# EAGLE design USBToILDAvAlpha (EAGLE 9.0.1)
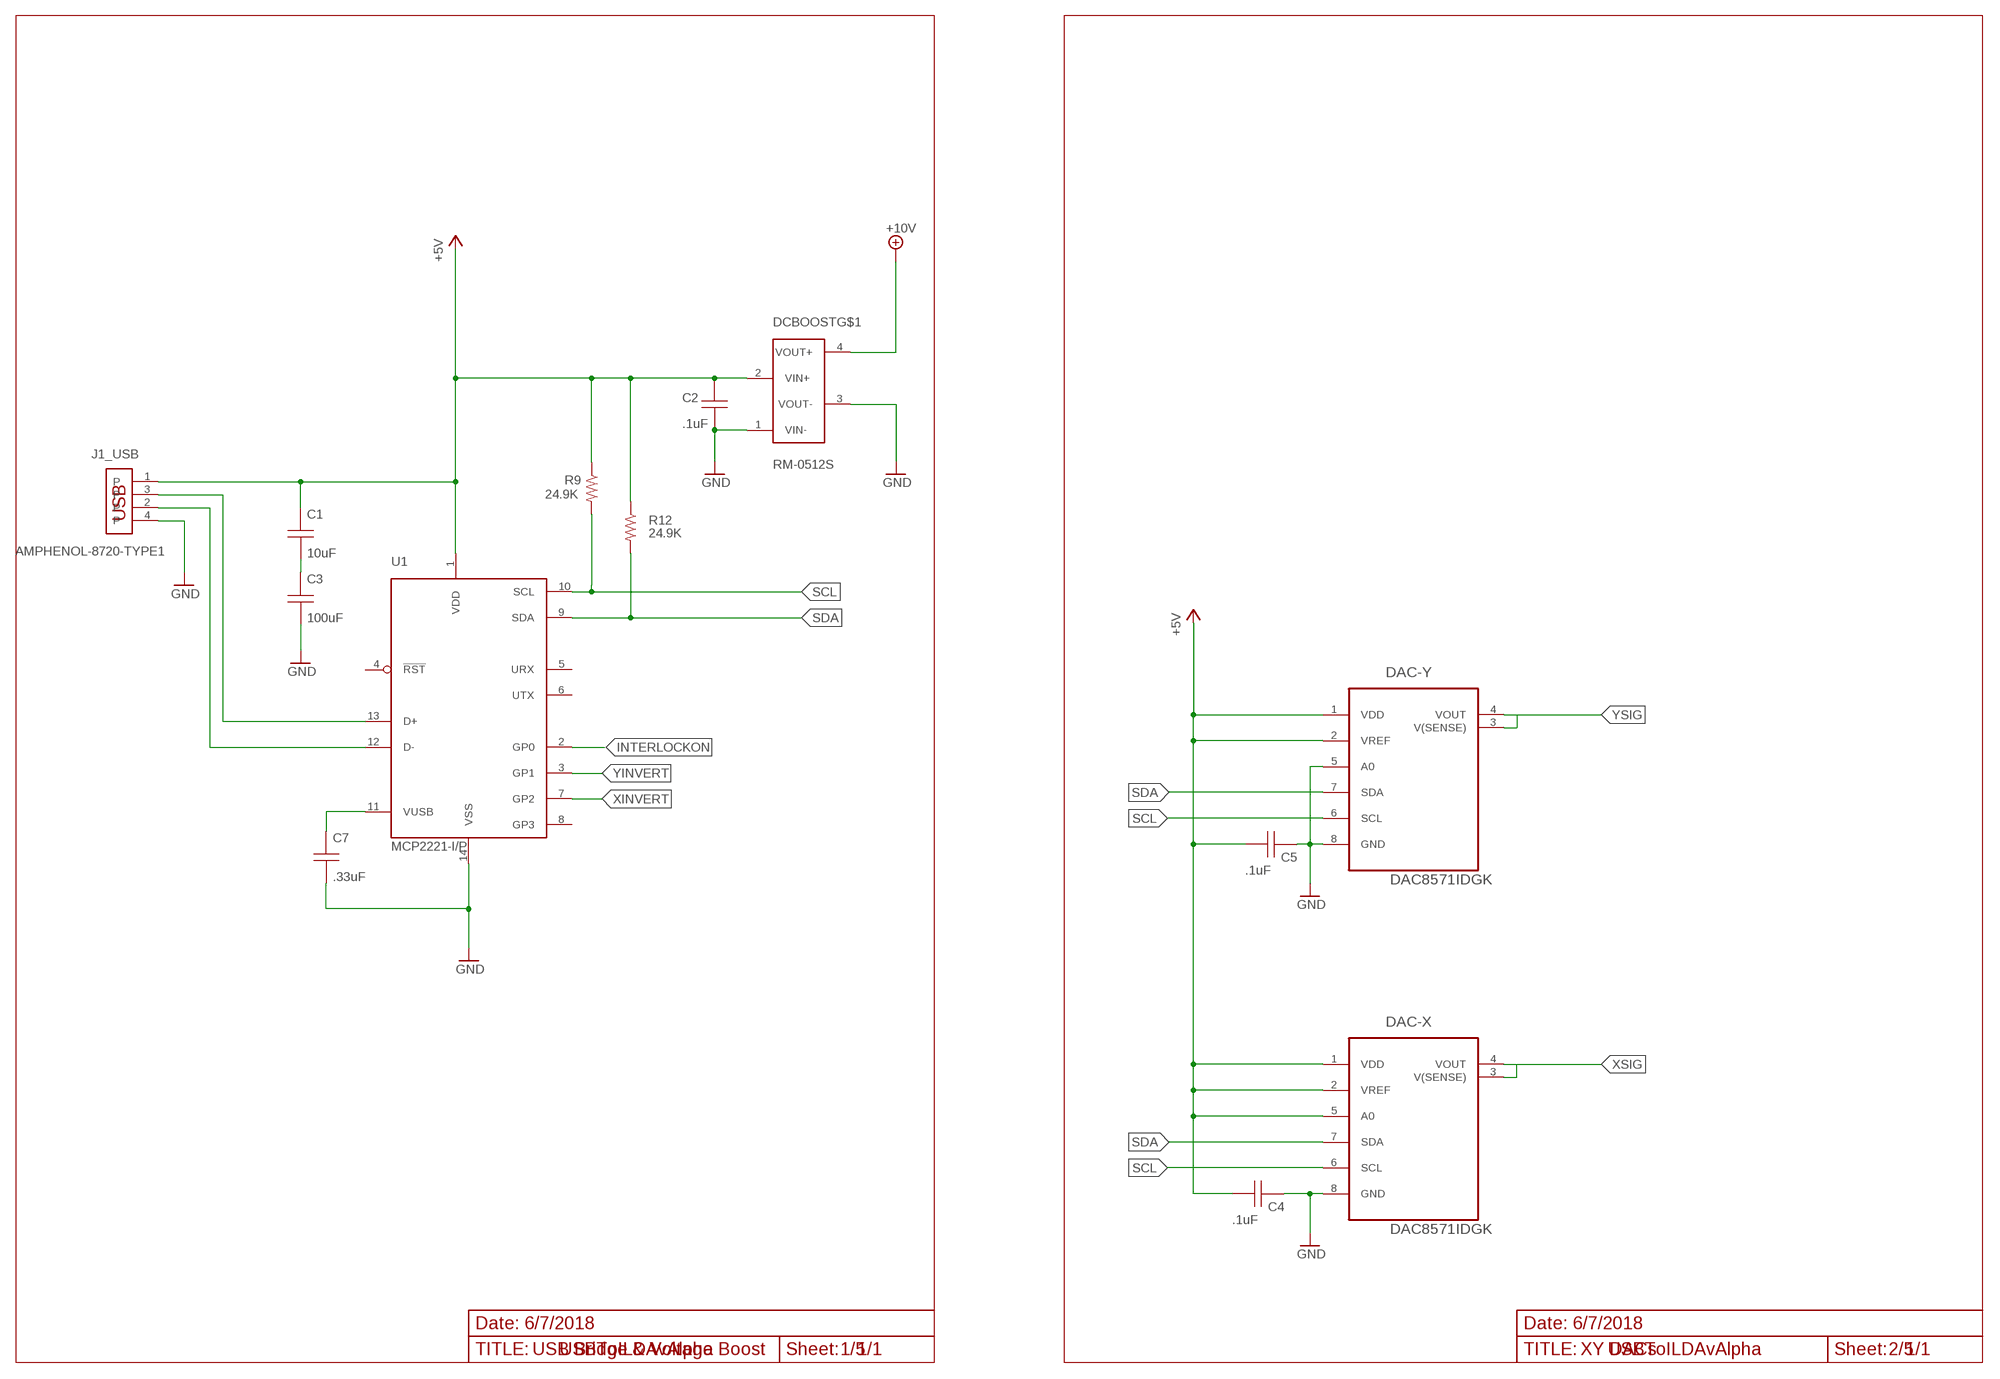
[diagram p0: schematic, sheet 1, part 1 of 3]
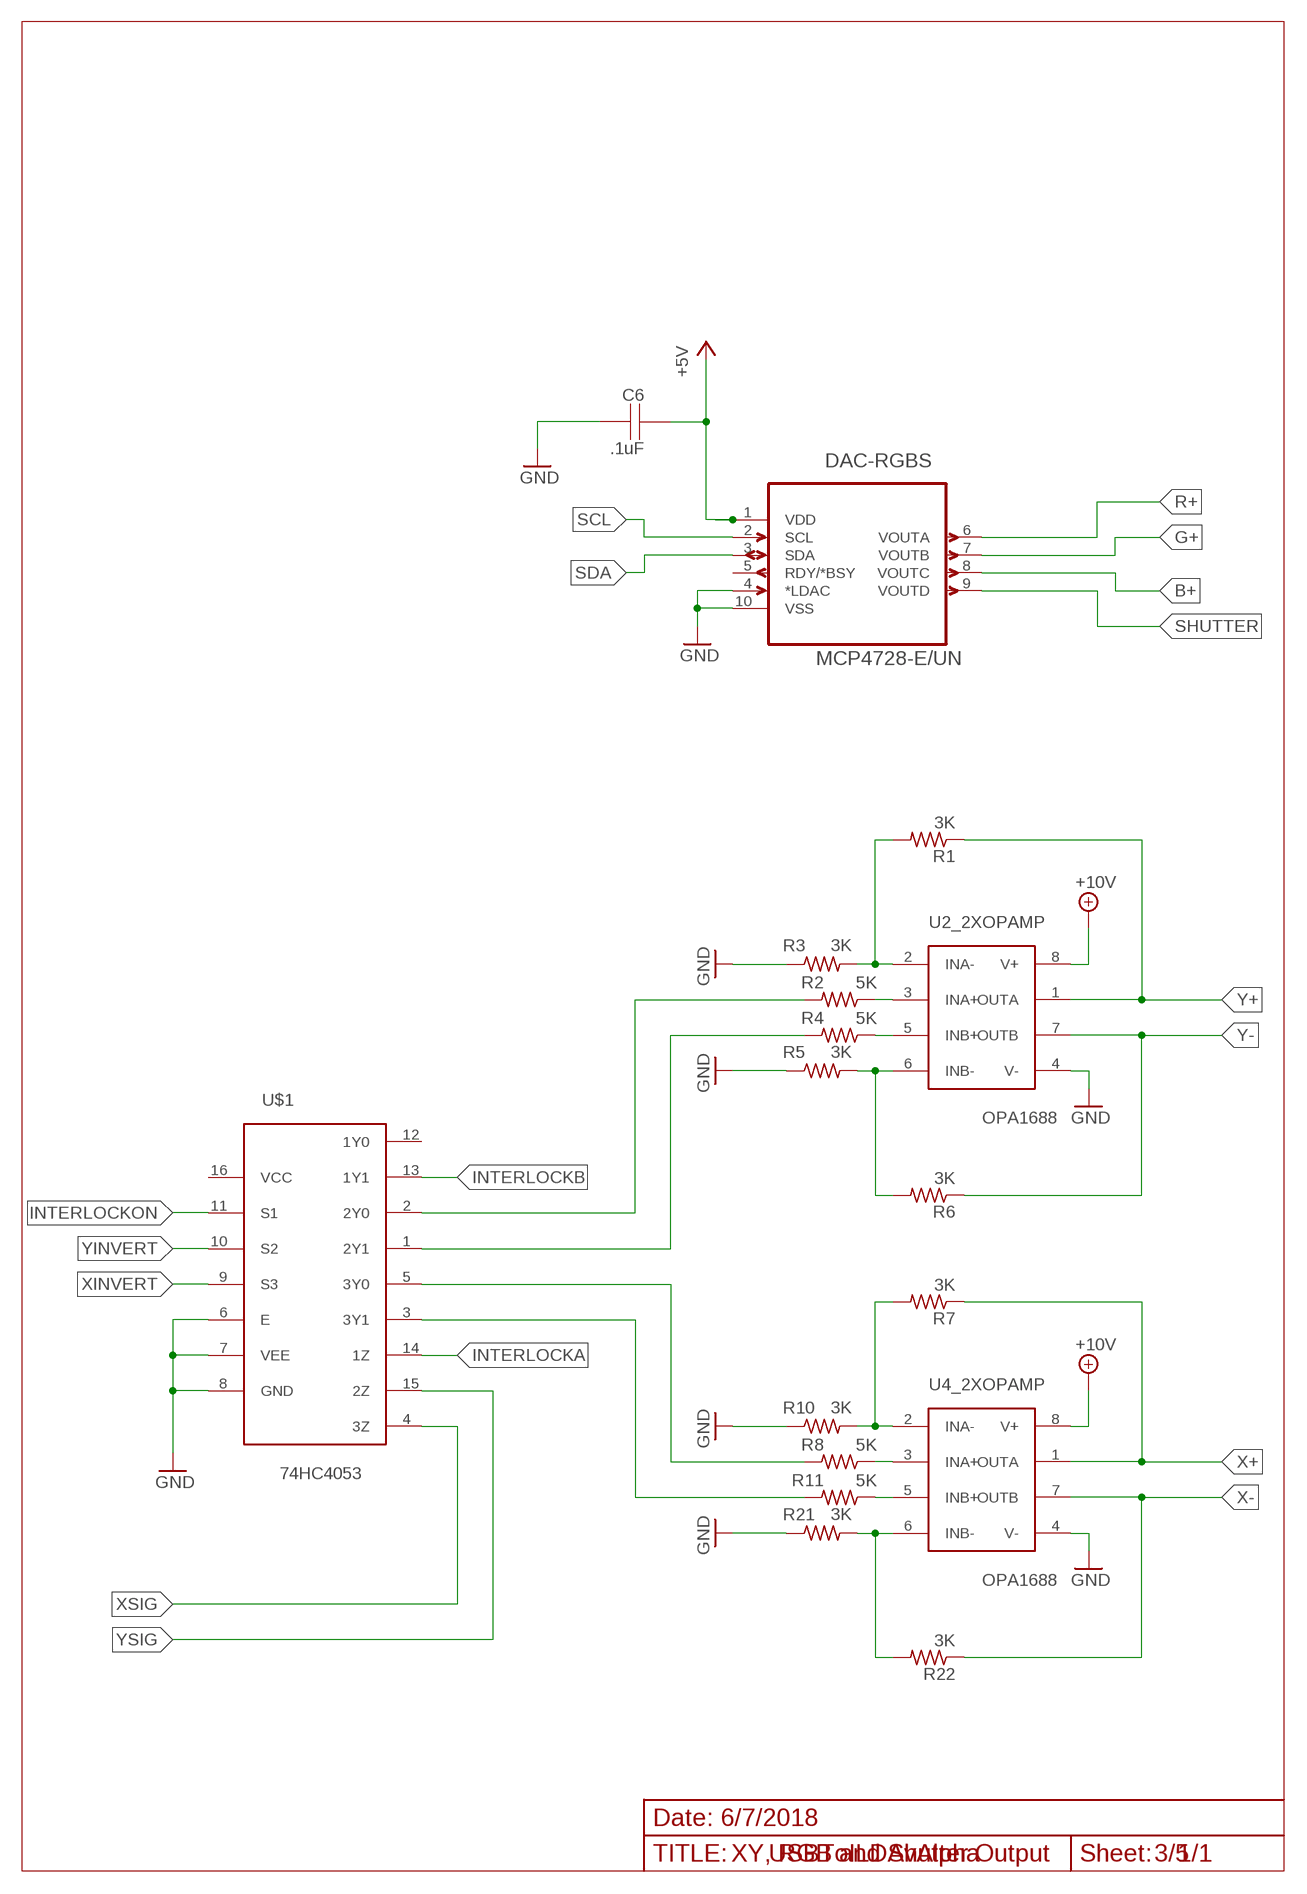
[diagram p1: schematic, sheet 1, part 2 of 3]
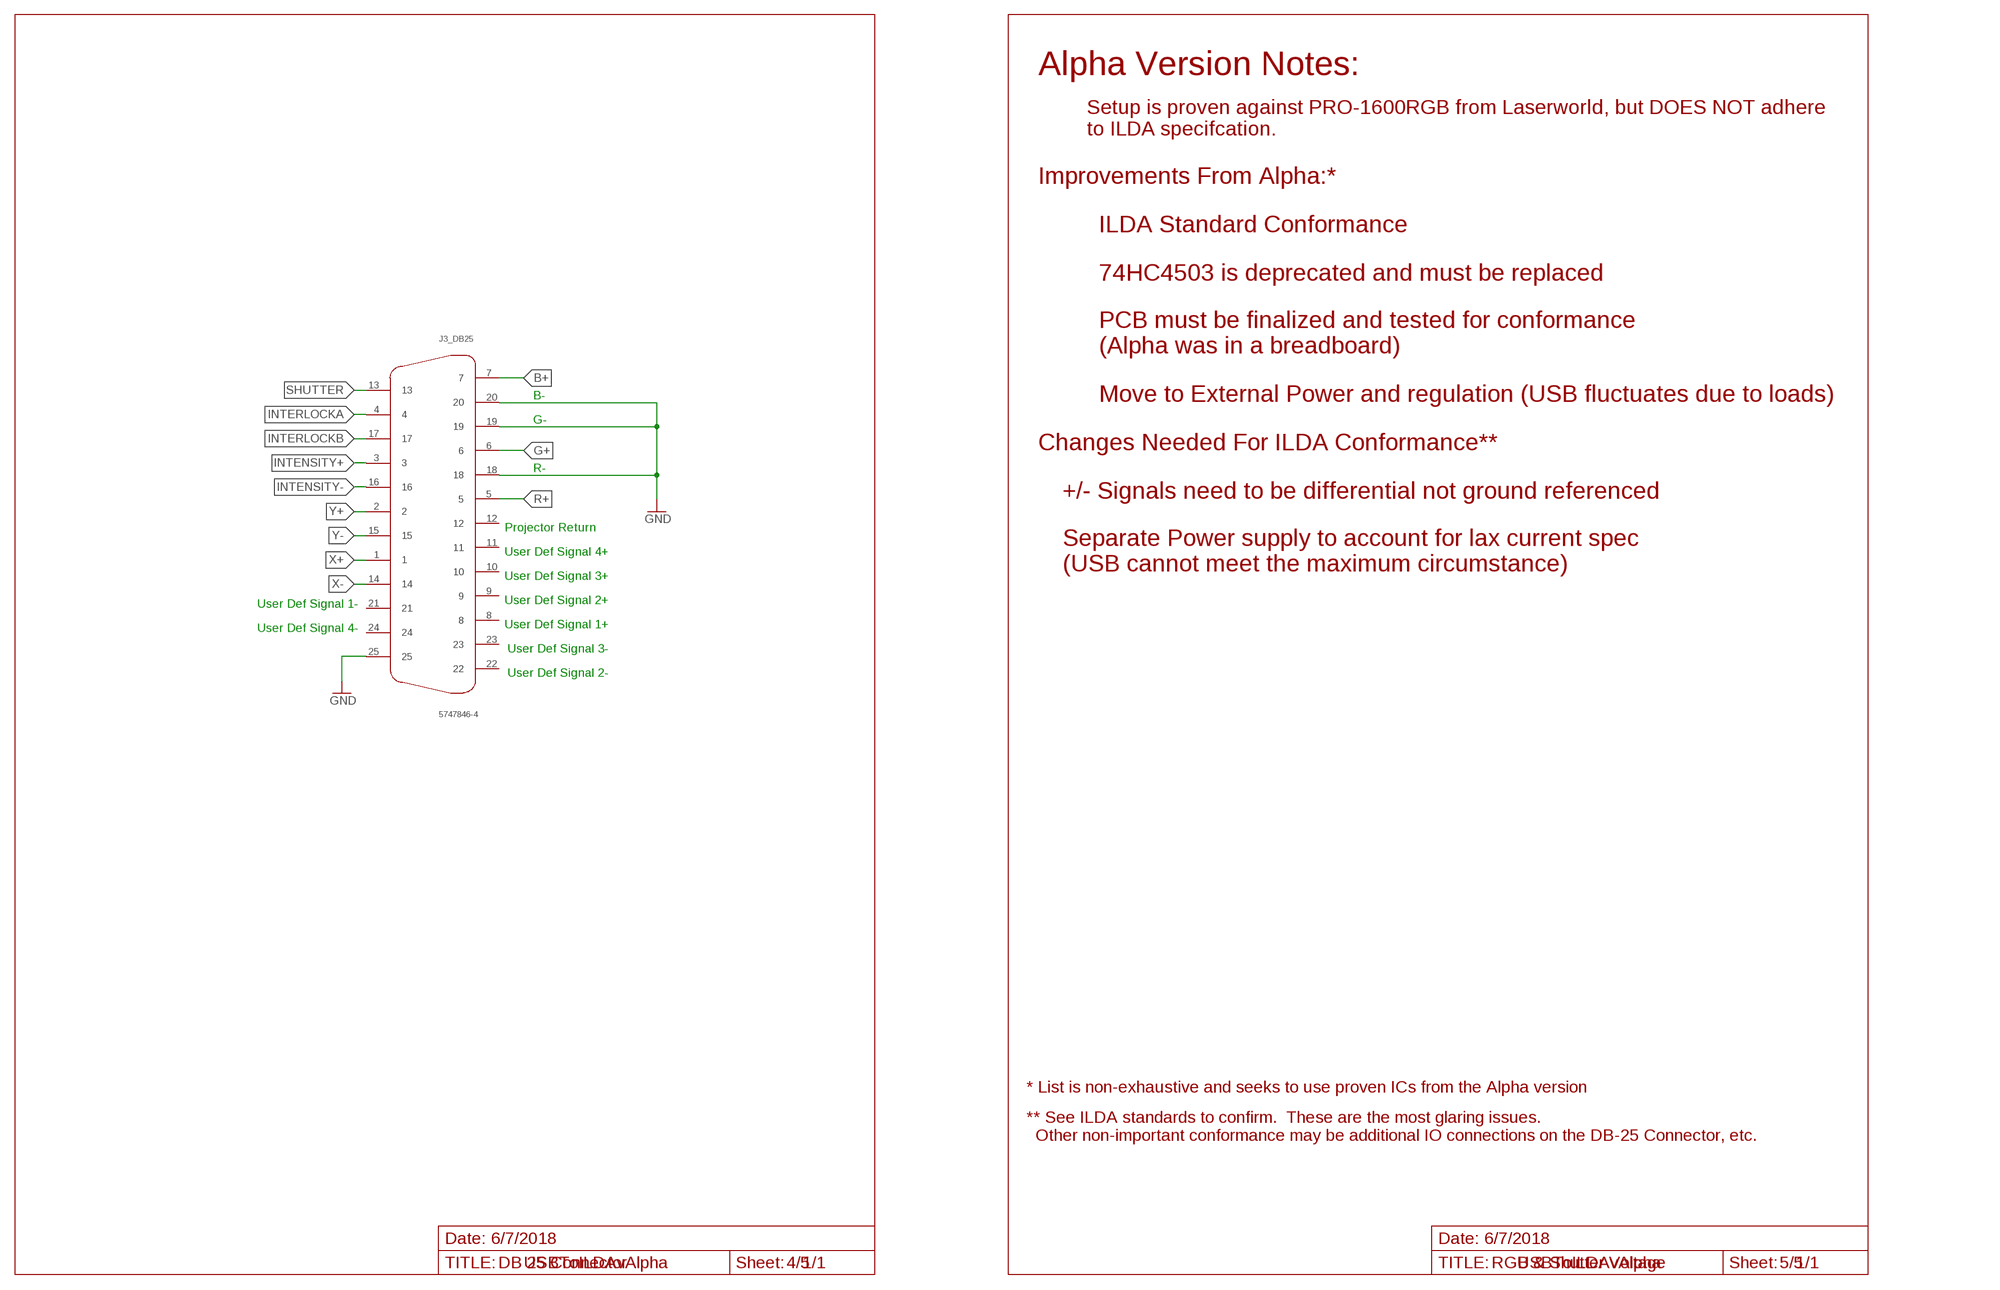
[diagram p2: schematic, sheet 1, part 3 of 3]

## Parts
C1  10uF  RCER71H106MWM1H03A  [WM1]
C2  .1uF  RCER71H106MWM1H03A  [WM1]
C3  100uF  RCER71H106MWM1H03A  [WM1]
C4  .1uF  RCER71H106MWM1H03A  [WM1]
C5  .1uF  RCER71H106MWM1H03A  [WM1]
C6  .1uF  RCER71H106MWM1H03A  [WM1]
C7  .33uF  RCER71H106MWM1H03A  [WM1]
DAC-RGBS  MCP4728-E/UN  [SOP50P490X110-10N]
DAC-X  DAC8571IDGK  [SOP65P490X110-8N]
DAC-Y  DAC8571IDGK  [SOP65P490X110-8N]
DCBOOST  RM-0512S  RM-XXXXS  [SIP-4]
J1_  AMPHENOL-8720-TYPE1  [87520]
J3_  5747846-4  [5747846-4]
R1  3K  R-US_01005  [R01005]
R2  5K  R-US_01005  [R01005]
R3  3K  R-US_01005  [R01005]
R4  5K  R-US_01005  [R01005]
R5  3K  R-US_01005  [R01005]
R6  3K  R-US_01005  [R01005]
R7  3K  R-US_01005  [R01005]
R8  5K  R-US_01005  [R01005]
R9  24.9K  R-US_01005  [R01005]
R10  3K  R-US_01005  [R01005]
R11  5K  R-US_01005  [R01005]
R12  24.9K  R-US_01005  [R01005]
R21  3K  R-US_01005  [R01005]
R22  3K  R-US_01005  [R01005]
U1  MCP2221-I/P  [DIL14]
U2  OPA1688  [SOIC-8]
U4  OPA1688  [SOIC-8]
U$1  74HC4053  [SO16]

## Nets
+5V: C1.P$1(A) C2.P$1(A) C4.P$1(A) C5.P$1(A) C6.P$2(B) DAC-RGBS.1(VDD) DAC-X.1(VDD) DAC-X.2(VREF) DAC-X.5(A0) DAC-Y.1(VDD) DAC-Y.2(VREF) DCBOOST.2(2:VIN+) J1_.1(1:P) R9.1 R12.1 U1.1(VDD)
+9V: DCBOOST.4(4:VOUT+) ; supply symbol labelled +10V
+10V: U2.8(8:V+) U4.8(8:V+)
B+: DAC-RGBS.8(VOUTC) J3_.7
G+: DAC-RGBS.7(VOUTB) J3_.6
GND: C2.P$2(B) C3.P$2(B) C4.P$2(B) C5.P$2(B) C6.P$1(A) C7.P$2(B) DAC-RGBS.4(*LDAC) DAC-RGBS.10(VSS) DAC-X.8(GND) DAC-Y.5(A0) DAC-Y.8(GND) DCBOOST.1(1:VIN-) DCBOOST.3(3:VOUT-) J1_.4(4:P) J3_.18 J3_.19 J3_.20 J3_.25 R3.1 R5.1 R10.1 R21.1 U1.14(VSS) U2.4(4:V-) U4.4(4:V-) U$1.6(E) U$1.7(VEE) U$1.8(GND)
INTENSITY+: J3_.3
INTENSITY-: J3_.16
INTERLOCKA: J3_.4 U$1.14(1Z)
INTERLOCKB: J3_.17 U$1.13(1Y1)
INTERLOCKON: U1.2(GP0) U$1.11(S1)
N$1: C1.P$2(B) C3.P$1(A)
N$2: J1_.2(2:P) U1.12(D-)
N$3: J1_.3(3:P) U1.13(D+)
N$4: R1.2 R3.2 U2.2(2:INA-)
N$6: DAC-RGBS.9(VOUTD)
N$7: R2.1 U2.3(3:INA+)
N$8: R2.2 U$1.2(2Y0)
N$9: R7.2 R10.2 U4.2(2:INA-)
N$10: R8.1 U4.3(3:INA+)
N$11: R8.2 U$1.5(3Y0)
N$12: R4.2 U$1.1(2Y1)
N$14: R4.1 U2.5(5:INB+)
N$15: R11.2 U$1.3(3Y1)
N$16: R5.2 R6.2 U2.6(6:INB-)
N$17: C7.P$1(A) U1.11(VUSB)
N$18: R11.1 U4.5(5:INB+)
N$19: R21.2 R22.2 U4.6(6:INB-)
R+: DAC-RGBS.6(VOUTA) J3_.5
SCL: DAC-RGBS.2(SCL) DAC-X.6(SCL) DAC-Y.6(SCL) R9.2 U1.10(SCL)
SDA: DAC-RGBS.3(SDA) DAC-X.7(SDA) DAC-Y.7(SDA) R12.2 U1.9(SDA)
SHUTTER: J3_.13
X+: J3_.1 R7.1 U4.1(1:OUTA)
X-: J3_.14 R22.1 U4.7(7:OUTB)
XINVERT: U1.7(GP2) U$1.9(S3)
XSIG: DAC-X.3(V(SENSE)) DAC-X.4(VOUT) U$1.4(3Z)
Y+: J3_.2 R1.1 U2.1(1:OUTA)
Y-: J3_.15 R6.1 U2.7(7:OUTB)
YINVERT: U1.3(GP1) U$1.10(S2)
YSIG: DAC-Y.3(V(SENSE)) DAC-Y.4(VOUT) U$1.15(2Z)
Unconnected: DAC-RGBS.5(RDY/*BSY) J3_.8 J3_.9 J3_.10 J3_.11 J3_.12 J3_.21 J3_.22 J3_.23 J3_.24 U1.4(!RST) U1.5(URX) U1.6(UTX) U1.8(GP3) U$1.12(1Y0) U$1.16(VCC)

## Notes on the sheet
- Alpha Version Notes:
- Setup is proven against PRO-1600RGB from Laserworld, but DOES NOT adhere 
  to ILDA specifcation.
- Improvements From Alpha:*
- ILDA Standard Conformance
- 74HC4503 is deprecated and must be replaced
- PCB must be finalized and tested for conformance 
  (Alpha was in a breadboard)
- B- | Move to External Power and regulation (USB fluctuates due to loads)
- G-
- Changes Needed For ILDA Conformance**
- R-
- +/- Signals need to be differential not ground referenced
- Projector Return
- User Def Signal 4+
- User Def Signal 3+
- Separate Power supply to account for lax current spec 
  (USB cannot meet the maximum circumstance)
- User Def Signal 2+
- User Def Signal 1-
- User Def Signal 1+
- User Def Signal 4-
- User Def Signal 3-
- User Def Signal 2-
- * List is non-exhaustive and seeks to use proven ICs from the Alpha version
- ** See ILDA standards to confirm.  These are the most glaring issues.
    Other non-important conformance may be additional IO connections on the DB-25 Connector, etc.
- 6/7/2018 | 6/7/2018 | 6/7/2018 | 6/7/2018 | 6/7/2018
- USB Bridge & Voltage Boost | 1/5 | XY DACs | 2/5 | XY, RGB and Shutter Output | 3/5 | DB 25 Connector | 4/5 | RGB & Shutter Voltage | 5/5

## Library data of the parts
C1-C7 = Capacitors:RCER71H106MWM1H03A
DAC-RGBS = Microchip_By_element14_Batch_1:MCP4728-E/UN: IC, DAC, 12BIT, QUAD; MPN: MCP4728-E/UN; OC_FARNELL: 1800217; OC_NEWARK: 08R1808; PACKAGE: MSOP-10; SUPPLIER: MICROCHIP
DAC-X DAC-Y = Texas Instruments_By_element14_Batch_1:DAC8571IDGK: 0.05ìV/°C max, SINGLE-SUPPLY CMOS OPERATIONAL AMPLIFIERS Zer.-Drift Series; MPN: DAC8571IDGK; OC_FARNELL: -; OC_NEWARK: 20H5068; PACKAGE: MSOP-8; SUPPLIER: Texas Instruments
DCBOOST = Recom:RM-XXXXS
J1_ = USB Connectors:AMPHENOL-8720-TYPE1
J3_ = DB Connectors:5747846-4
R1-R12 R21 R22 = resistor:R-US_: RESISTOR, American symbol
U1 = microchip-mcp2221:MCP2221-*: MCP2221 in PDIP, SOIC and TSSOP package The MCP2221 is a USB-to-UART/I2C serial converter which enables USB connectivity in applications that have a UART and I2C interfaces. The device reduces external components by integrating the USB termination resistors and the oscillator needed for USB operation. The MCP2221 also has four GP pins providing miscellaneous functionalities (GPIO, USBCFG, SSPND, Clock Output, ADC, DAC, interrupt detector). Source: www.microchip.com/MCP2221 <http://www.microchip.com/wwwproducts/Devices.aspx?product=MCP2221> and www.microchipdirect.com <http://www.microchipdirect.com/ProductDetails.aspx?Category=MCP2221> Tutorial: MCP2221 by Arnauld Biganzoli <https://docs.google.com/document/d/1P3zzqCKdEXzCe--1Yyg8PClCZKsUri8pyNO7AV2daaw/edit?usp=sharing>
U2 U4 = TI:OPA1688
U$1 = Nexperia:74HC4053

## Board
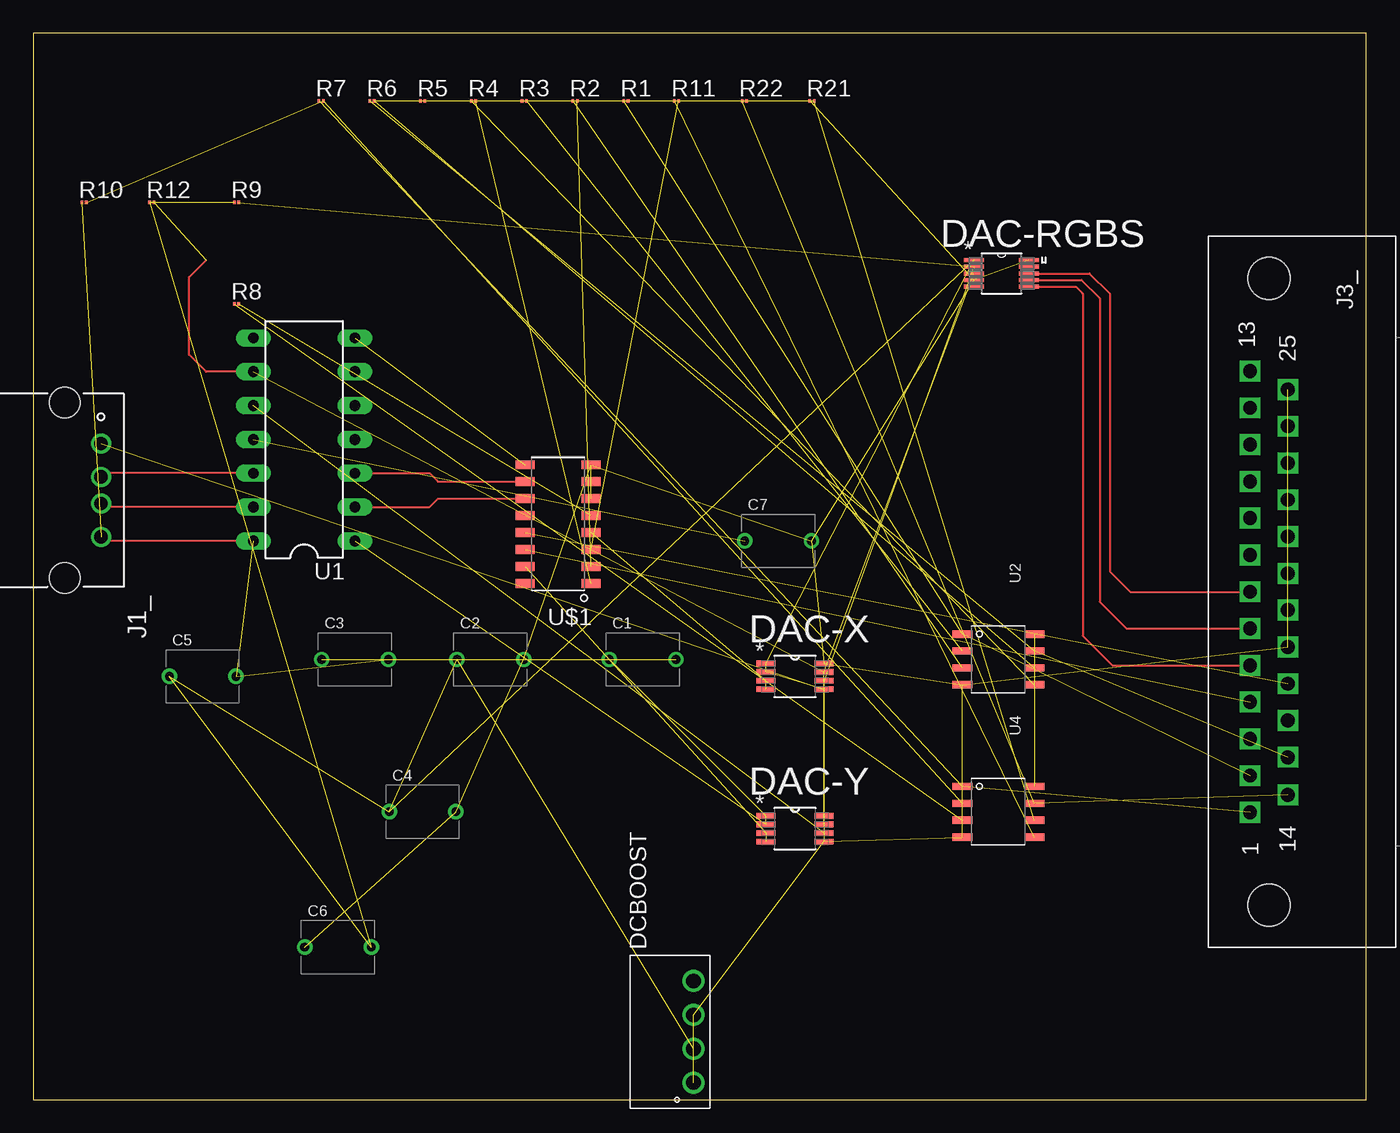
[diagram p3: board, top side]

Size 100 x 80 mm. Coordinates in mm from the lower left corner, seen from the top.
Outline: 0,0 100,0 100,80 0,80 0,0
Copper layers (1*16): Top 0.035mm / dielectric 1.5mm / Bottom 0.035mm
Design rules "default": minimum track width 6mil, minimum drill 0.35mm, track to track 6mil, track to pad 6mil, pad to pad 6mil, via to via 6mil, smd to smd 6mil, copper to edge 40mil, drill to drill 6mil, minimum pad ring 10mil, minimum via ring 8mil, stop-mask expansion 4mil, vias tented up to drill 0mil, thermal gap 10mil

### Footprints (pad centres in the part's own frame; a part is rotated, then mirrored left to right if it is on the bottom)
WM1 = drill 0.65: P$1 -2.5,0; P$2 2.5,0
SOP50P490X110-10N = smd 1.499 x 0.305: 1 -2.057,0.991; 2 -2.057,0.508; 3 -2.057,0; 4 -2.057,-0.508; 5 -2.057,-0.991; 6 2.057,-0.991; 7 2.057,-0.508; 8 2.057,0; 9 2.057,0.508; 10 2.057,0.991
SOP65P490X110-8N = smd 1.422 x 0.432: 1 -2.184,0.965; 2 -2.184,0.33; 3 -2.184,-0.33; 4 -2.184,-0.965; 5 2.184,-0.965; 6 2.184,-0.33; 7 2.184,0.33; 8 2.184,0.965
SIP-4 = drill 1.1: 1 -3.81,0; 2 -1.27,0; 3 1.27,0; 4 3.81,0
87520 = drill 1: 1 -3.5,0; 2 -1,0; 3 1,0; 4 3.5,0 | hole 2.3: -6.57,-2.71; 6.57,-2.71
5747846-4 = drill 1.041 square: 1 16.561,-1.422; 2 13.801,-1.422; 3 11.041,-1.422; 4 8.28,-1.422; 5 5.52,-1.422; 6 2.76,-1.422; 7 0,-1.422; 8 -2.76,-1.422; 9 -5.52,-1.422; 10 -8.28,-1.422; 11 -11.041,-1.422; 12 -13.801,-1.422; 13 -16.561,-1.422; 14 15.24,1.422; 15 12.417,1.422; 16 9.658,1.422; 17 6.898,1.422; 18 4.139,1.422; 19 1.38,1.422; 20 -1.38,1.422; 21 -4.139,1.422; 22 -6.898,1.422; 23 -9.658,1.422; 24 -12.417,1.422; 25 -15.177,1.422 | hole 3.175: -23.52,0; 23.52,0
R01005 = smd 0.2 x 0.25: 1 -0.163,0; 2 0.163,0
DIL14 = drill 0.813 long: 1 -7.62,-3.81; 2 -5.08,-3.81; 3 -2.54,-3.81; 4 0,-3.81; 5 2.54,-3.81; 6 5.08,-3.81; 7 7.62,-3.81; 8 7.62,3.81; 9 5.08,3.81; 10 2.54,3.81; 11 0,3.81; 12 -2.54,3.81; 13 -5.08,3.81; 14 -7.62,3.81
SOIC-8 = smd 0.55 x 1.5: 1 -1.905,-2.7; 2 -0.635,-2.7; 3 0.635,-2.7; 4 1.905,-2.7; 5 1.905,2.7; 6 0.635,2.7; 7 -0.635,2.7; 8 -1.905,2.7
SO16 = smd 0.67 x 1.45: 1 -4.445,-2.475; 2 -3.175,-2.475; 3 -1.905,-2.475; 4 -0.635,-2.475; 5 0.635,-2.475; 6 1.905,-2.475; 7 3.175,-2.475; 8 4.445,-2.475; 9 4.445,2.475; 10 3.175,2.475; 11 1.905,2.475; 12 0.635,2.475; 13 -0.635,2.475; 14 -1.905,2.475; 15 -3.175,2.475; 16 -4.445,2.475

### Placement (x,y rotation side)
C1  45.72,33.02 0 top
C2  34.29,33.02 0 top
C3  24.13,33.02 0 top
C4  29.21,21.59 0 top
C5  12.7,31.75 0 top
C6  22.86,11.43 0 top
C7  55.88,41.91 0 top
DAC-RGBS  72.64,61.98 0 top
DAC-X  57.15,31.75 0 top
DAC-Y  57.15,20.32 0 top
DCBOOST  49.53,5.08 90 top
J1_  5.08,45.72 270 top
J3_  92.71,38.1 270 top
R1  44.45,74.93 0 top
R2  40.64,74.93 0 top
R3  36.83,74.93 0 top
R4  33.02,74.93 0 top
R5  29.21,74.93 0 top
R6  25.4,74.93 0 top
R7  21.59,74.93 0 top
R8  15.24,59.69 0 top
R9  15.24,67.31 0 top
R10  3.81,67.31 0 top
R11  48.26,74.93 0 top
R12  8.89,67.31 0 top
R21  58.42,74.93 0 top
R22  53.34,74.93 0 top
U1  20.32,49.53 90 top
U2  72.39,33.02 270 top
U4  72.39,21.59 270 top
U$1  39.37,43.18 90 top

### Tracks (layer width: path | path; a pad name or v marks a point on that pad's centre or on a via)
+5V  (15 unrouted)
+10V  (1 unrouted)
B+
  Top 0.152: DAC-RGBS.8 79.25,61.98 80.77,60.45 80.77,39.62 82.3,38.1 J3_.7
G+
  Top 0.152: DAC-RGBS.7 74.93,61.49 78.64,61.49 80.01,60.12 80.01,37.34 82.01,35.34 J3_.6
GND  (26 unrouted)
  Top 0.152: U1.14 5.39,41.91 J1_.4
INTERLOCKA  (1 unrouted)
INTERLOCKB  (1 unrouted)
INTERLOCKON
  Top 0.152: U1.2 29.72,44.45 30.35,45.09 U$1.11
N$1  (1 unrouted)
N$2
  Top 0.152: U1.12 5.35,46.99 J1_.2
N$3
  Top 0.152: U1.13 5.35,44.45 J1_.3
N$4  (2 unrouted)
N$7  (1 unrouted)
N$8  (1 unrouted)
N$9  (2 unrouted)
N$10  (1 unrouted)
N$11  (1 unrouted)
N$12  (1 unrouted)
N$14  (1 unrouted)
N$15  (1 unrouted)
N$16  (2 unrouted)
N$17  (1 unrouted)
N$18  (1 unrouted)
N$19  (2 unrouted)
R+
  Top 0.152: DAC-RGBS.6 78.21,60.98 78.74,60.45 78.74,34.8 80.96,32.58 J3_.5
SCL  (4 unrouted)
SDA  (4 unrouted)
  Top 0.152: U1.9 12.95,54.61 11.68,55.88 11.68,61.72 12.95,62.99
X+  (2 unrouted)
X-  (2 unrouted)
XINVERT  (1 unrouted)
XSIG  (2 unrouted)
Y+  (2 unrouted)
Y-  (2 unrouted)
YINVERT
  Top 0.152: U1.3 29.72,46.99 30.35,46.35 U$1.10
YSIG  (2 unrouted)